# EAGLE design P82B96-I2c-Bus-Extender-V02-005 (EAGLE 9.1.1)
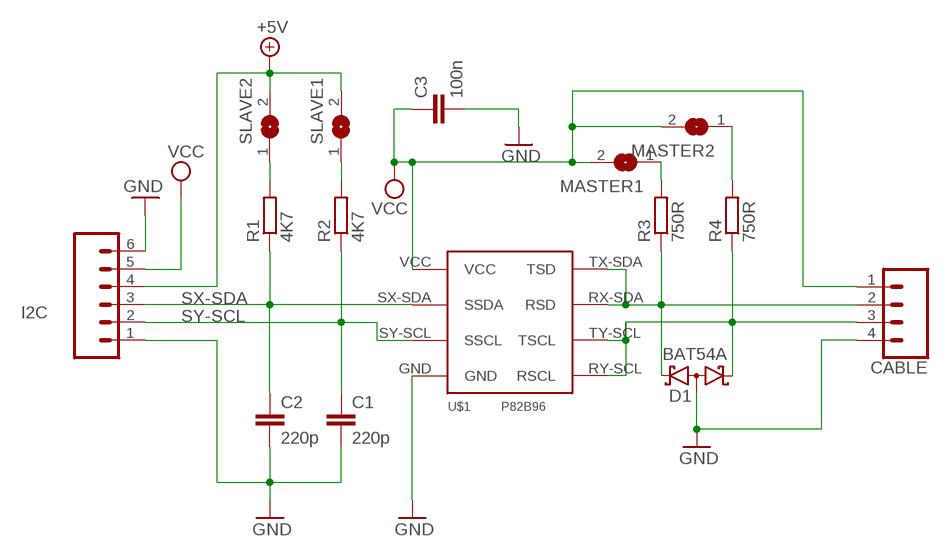
[diagram p0: schematic, sheet 1]

## Parts
C1  220p  C-EUC0805K  [C0805K]
C2  220p  C-EUC0805K  [C0805K]
C3  100n  C-EUC0805K  [C0805K]
CABLE  CONN_04LOCK_LONGPADS  [1X04_LOCK_LONGPADS]
D1  BAT54A  [SOT23]
I2C  CONN_06LONGPADS  [1X06_LONGPADS]
MASTER1  SJ  [SJ]
MASTER2  SJ  [SJ]
R1  4K7  R-EU_R0805W  [R0805W]
R2  4K7  R-EU_R0805W  [R0805W]
R3  750R  R-EU_R0805W  [R0805W]
R4  750R  R-EU_R0805W  [R0805W]
SLAVE1  SJ  [SJ]
SLAVE2  SJ  [SJ]
U$1  P82B96-NEW  [SOIC8]

## Nets
+5V: I2C.4 SLAVE1.2 SLAVE2.2
GND: C1.2 C2.2 C3.2 CABLE.4 D1.3(AA) I2C.1 I2C.6 U$1.GND
N$3: R2.2 SLAVE1.1
N$4: R1.2 SLAVE2.1
N$5: MASTER2.1 R4.2
N$6: MASTER1.1 R3.2
RX-SDA: CABLE.2 D1.2(K2) R3.1 U$1.RX-SDA(RSD) U$1.TX-SDA(TSD)
SX-SDA: C2.1 I2C.3 R1.1 U$1.SX-SDA(SSDA)
SY-SCL: C1.1 I2C.2 R2.1 U$1.SY-SCL(SSCL)
TY-SCL: CABLE.3 D1.1(K1) R4.1 U$1.RY-SCL(RSCL) U$1.TY-SCL(TSCL)
VCC: C3.1 CABLE.1 I2C.5 MASTER1.2 MASTER2.2 U$1.VCC

## Library data of the parts
C1-C3 = rcl:C-EU: CAPACITOR, European symbol; SPICEPREFIX: C
CABLE = SparkFun-Connectors:CONN_04: Multi connection point. Often used as Generic Header-pin footprint for 0.1 inch spaced/style header connections On any of the 0.1 inch spaced packages, you can populate with these: Break Away Headers - Straight <https://www.sparkfun.com/products/116> (PRT-00116) Break Away Male Headers - Right Angle <https://www.sparkfun.com/products/553> (PRT-00553) Female Headers <https://www.sparkfun.com/products/115> (PRT-00115) Break Away Headers - Machine Pin <https://www.sparkfun.com/products/117> (PRT-00117) Break Away Female Headers - Swiss Machine Pin <https://www.sparkfun.com/products/743> (PRT-00743) For SCREWTERMINALS and SPRING TERMINALS visit here: Screw Terimnals on SparkFun.com <https://www.sparkfun.com/search/results?term=Screw+Terminals> (5mm/3.5mm/2.54mm spacing) This device is also useful as a general connection point to wire up your design to another part of your project. Our various solder wires solder well into these plated through hole pads. Hook-Up Wire - Assortment (Stranded, 22 AWG) <https://www.sparkfun.com/products/11375> (PRT-11375) Hook-Up Wire - Assortment (Solid Core, 22 AWG) <https://www.sparkfun.com/products/11367> (PRT-11367) View the entire wire category on our website here <https://www.sparkfun.com/categories/141> Special notes: Molex polarized connector foot print use with SKU : PRT-08231 with associated crimp pins and housings. 1MM SMD Version SKU: PRT-10208; PROD_ID: CONN-09696
D1 = diode:BAT54A: Schottky Diodes Source: Fairchild .. BAT54.pdf
I2C = SparkFun-Connectors:CONN_06: Multi connection point. Often used as Generic Header-pin footprint for 0.1 inch spaced/style header connections On any of the 0.1 inch spaced packages, you can populate with these: Break Away Headers - Straight <https://www.sparkfun.com/products/116> (PRT-00116) Break Away Male Headers - Right Angle <https://www.sparkfun.com/products/553> (PRT-00553) Female Headers <https://www.sparkfun.com/products/115> (PRT-00115) Break Away Headers - Machine Pin <https://www.sparkfun.com/products/117> (PRT-00117) Break Away Female Headers - Swiss Machine Pin <https://www.sparkfun.com/products/743> (PRT-00743) Arduino Stackable Header - 6 Pin <https://www.sparkfun.com/products/9280> (PRT-09280) For SCREWTERMINALS and SPRING TERMINALS visit here: Screw Terimnals on SparkFun.com <https://www.sparkfun.com/search/results?term=Screw+Terminals> (5mm/3.5mm/2.54mm spacing) This device is also useful as a general connection point to wire up your design to another part of your project. Our various solder wires solder well into these plated through hole pads. Hook-Up Wire - Assortment (Stranded, 22 AWG) <https://www.sparkfun.com/products/11375> (PRT-11375) Hook-Up Wire - Assortment (Solid Core, 22 AWG) <https://www.sparkfun.com/products/11367> (PRT-11367) View the entire wire category on our website here <https://www.sparkfun.com/categories/141>
MASTER1 MASTER2 SLAVE1 SLAVE2 = jumper:SJ: SMD solder JUMPER
R1-R4 = rcl:R-EU_: RESISTOR, European symbol; SPICEPREFIX: R
U$1 = P82B96:P82B96-NEW: P82B96 - I2C buffer

## Net classes
0 default: width 0.457 mm

## Board
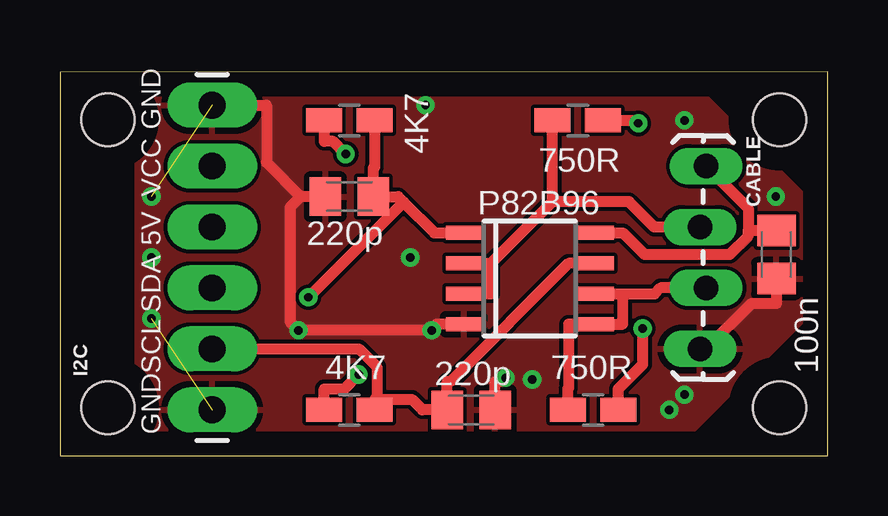
[diagram p1: board, top side]
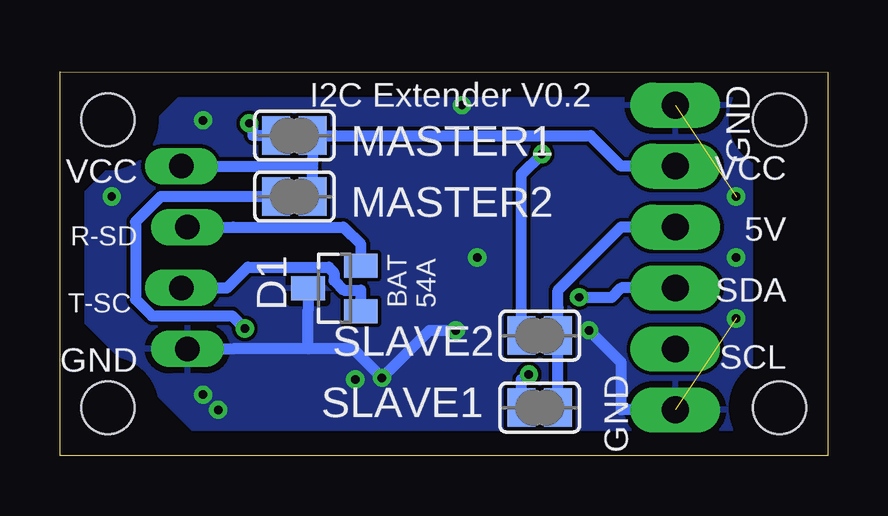
[diagram p2: board, bottom side, seen from below]

Size 32 x 16 mm. Coordinates in mm from the lower left corner, seen from the top.
Outline: 0,0 32,0 32,16 0,15.97 0,0
Copper layers (1*16): Top 0.035mm / dielectric 1.5mm / Bottom 0.035mm
Design rules "default": minimum track width 6mil, minimum drill 0.35mm, track to track 6mil, track to pad 6mil, pad to pad 6mil, via to via 6mil, smd to smd 6mil, copper to edge 40mil, drill to drill 6mil, minimum pad ring 10mil, minimum via ring 8mil, stop-mask expansion 4mil, vias tented up to drill 0mil, thermal gap 10mil
Holes 2.2 mm at 2,2 2,14 30,14 30,2

### Footprints (pad centres in the part's own frame; a part is rotated, then mirrored left to right if it is on the bottom)
C0805K = smd 1.3 x 1.6: 1 -1,0; 2 1,0
1X04_LOCK_LONGPADS = drill 1.016 long: 1 0,0; 2 2.54,-0.254; 3 5.08,0; 4 7.62,-0.254
SOT23 = smd 1 x 1.4: 1 -0.95,-1.1; 2 0.95,-1.1; 3 0,1.1
1X06_LONGPADS = drill 1.118 pad 1.88 long: 1 0,0; 2 2.54,0; 3 5.08,0; 4 7.62,0; 5 10.16,0; 6 12.7,0
SJ = smd 1.168 x 1.6: 1 -0.762,0; 2 0.762,0
R0805W = smd 1.5 x 1: 1 -1.052,0; 2 1.052,0
SOIC8 = smd 0.6 x 1.5: GND 1.905,-2.75; RX-SDA -0.635,-2.75; RY-SCL 0.635,2.75; SX-SDA -1.905,-2.75; SY-SCL -0.635,2.75; TX-SDA 0.635,-2.75; TY-SCL 1.905,2.75; VCC -1.905,2.75

### Placement (x,y rotation side)
C1  17.14,1.91 0 top
C2  12.06,10.79 180 top
C3  29.87,8.38 270 top
CABLE  26.94,12.06 270 top
D1  20.55,6.97 90 bottom
I2C  6.35,1.91 90 top
MASTER1  22.23,13.34 0 bottom
MASTER2  22.23,10.79 0 bottom
R1  12.06,13.97 180 top
R2  12.06,1.91 180 top
R3  21.59,13.97 0 top
R4  22.23,1.91 0 top
SLAVE1  12,2 0 bottom
SLAVE2  12,5 0 bottom
U$1  19.59,7.38 270 top

### Tracks (layer width: path | path; a pad name or v marks a point on that pad's centre or on a via)
+5V
  Bottom 0.457: I2C.4 8.61,9.53 11.24,6.9 11.24,6.18 SLAVE2.2 SLAVE1.2
GND  (via drill 0.35, 0.35 pad 0.76)  (2 unrouted)
  Top 0.457: 10.03,10.79 9.6,10.36 9.6,5.56 v9.95,5.22 v15.5,5.22 15.5,5.27 15.7,5.47 U$1.GND | C3.2 29.87,6.35 28.84,6.35 26.93,4.45 CABLE.4 | I2C.6 8.61,14.61 8.61,12.22 10.03,10.79 | C2.2 10.03,10.79 | v18.58,3.24 18.42,3.09 18.14,3.09 C1.2
  Bottom 0.457: 21.66,4.45 21.66,6.09 D1.3 | v18.58,3.24 19.78,4.45 21.66,4.45 | 21.66,4.45 24.78,4.45 CABLE.4 | v18.58,3.24 16.6,5.22 v15.5,5.22 | v18.58,3.24 | I2C.1 8.61,1.91 8.61,3.88 v9.95,5.22
  other vias: 3.81,10.79 3.81,5.71 3.81,8.26 14.61,8.26 15.24,14.61 26.04,13.97 26.04,2.54 25.4,1.91 19.68,3.17 29.84,10.79
  pour Top: 3.17,15.24 26.67,15.24 31.11,10.79 31.11,5.71 26.04,0.64 3.17,0.64
  pour Bottom: 3.17,15.24 26.67,15.24 31.11,10.79 31.11,5.71 26.04,0.64 3.17,0.64
N$3  (via drill 0.35 pad 0.76)
  Top 0.457: v12.45,3.38 11.86,2.79 11.01,2.79 R2.2
  Bottom 0.457: v12.45,3.38 12.65,3.18 12.76,3.18 SLAVE1.1
N$4  (via drill 0.35 pad 0.76)
  Top 0.457: v11.91,12.57 11.39,13.09 11.01,13.09 R1.2
  Bottom 0.457: SLAVE2.1 12.76,11.71 v11.91,12.57
N$5  (via drill 0.35 pad 0.76)
  Top 0.457: v24.3,5.29 24.3,3.8 23.28,2.79 R4.2
  Bottom 0.457: MASTER2.1 27.8,10.79 28.84,9.74 28.84,6.51 28.16,5.82 24.82,5.82 v24.3,5.29
N$6  (via drill 0.35 pad 0.76)
  Top 0.457: R3.2 23.99,13.97 v24.11,13.85
  Bottom 0.457: MASTER1.1 23.95,13.34 23.95,13.69 v24.11,13.85
RX-SDA
  Top 0.457: 20.54,10.59 R3.1 | 20.54,10.59 23.72,10.59 24.78,9.53 CABLE.2 | 17.97,8.02 20.54,10.59 | 17.97,8.02 17.4,8.02 U$1.RX-SDA | U$1.TX-SDA 17.97,6.75 17.97,8.02
  Bottom 0.457: D1.2 19.45,8.8 20.18,9.53 24.78,9.53 CABLE.2
SX-SDA  (via drill 0.35 pad 0.76)
  Top 0.457: 14.32,10.57 15.61,9.29 U$1.SX-SDA | 14.32,10.57 14.1,10.79 C2.1 13.06,11.98 13.12,12.03 R1.1 | 14.32,10.57 v10.36,6.6
  Bottom 0.457: I2C.3 8.61,6.99 9,6.6 v10.36,6.6
SY-SCL
  Top 0.457: I2C.2 8.61,4.45 12.46,4.45 13.21,3.69 13.21,2.44 13.12,2.35 | 13.12,2.35 14.67,2.35 15.11,1.91 C1.1 16.14,3.09 16.27,3.09 21.2,8.02 U$1.SY-SCL | R2.1 13.12,2.35
TY-SCL
  Top 0.457: R4.1 21.17,2.79 21.2,2.82 21.2,5.47 U$1.TY-SCL 22.39,5.47 23.47,5.47 23.47,6.75 | CABLE.3 25.04,6.99 24.8,6.75 23.47,6.75 | 23.47,6.75 23.31,6.75 U$1.RY-SCL
  Bottom 0.457: D1.1 19.45,6.9 20.18,6.9 20.57,7.3 20.57,7.63 20.8,7.85 24.17,7.85 25.04,6.99 CABLE.3
VCC
  Top 0.457: CABLE.1 28.69,10.32 28.69,9.38 | C3.1 28.69,9.38 | U$1.VCC 23.47,9.29 24.37,8.38 27.93,8.38 28.69,9.14 28.69,9.38
  Bottom 0.457: 21.55,12.06 21.46,11.98 MASTER2.2 | CABLE.1 21.55,12.06 | 21.55,12.06 21.46,12.15 MASTER1.2 20.5,13.34 9.88,13.34 8.61,12.06 I2C.5

### Text on the board
tNames: GND | 4K7 | 750R | VCC | P82B96 | 5V | 220p | SDA | SCL | 4K7 | 220p | 750R | 100n | GND
bNames: I2C Extender V0.2 | GND | VCC | VCC | 5V | R-SD | SDA | T-SC | BAT / 54A | SCL | GND | GND